# EAGLE design CC2530 Arduino Shield (EAGLE 9.5.0)
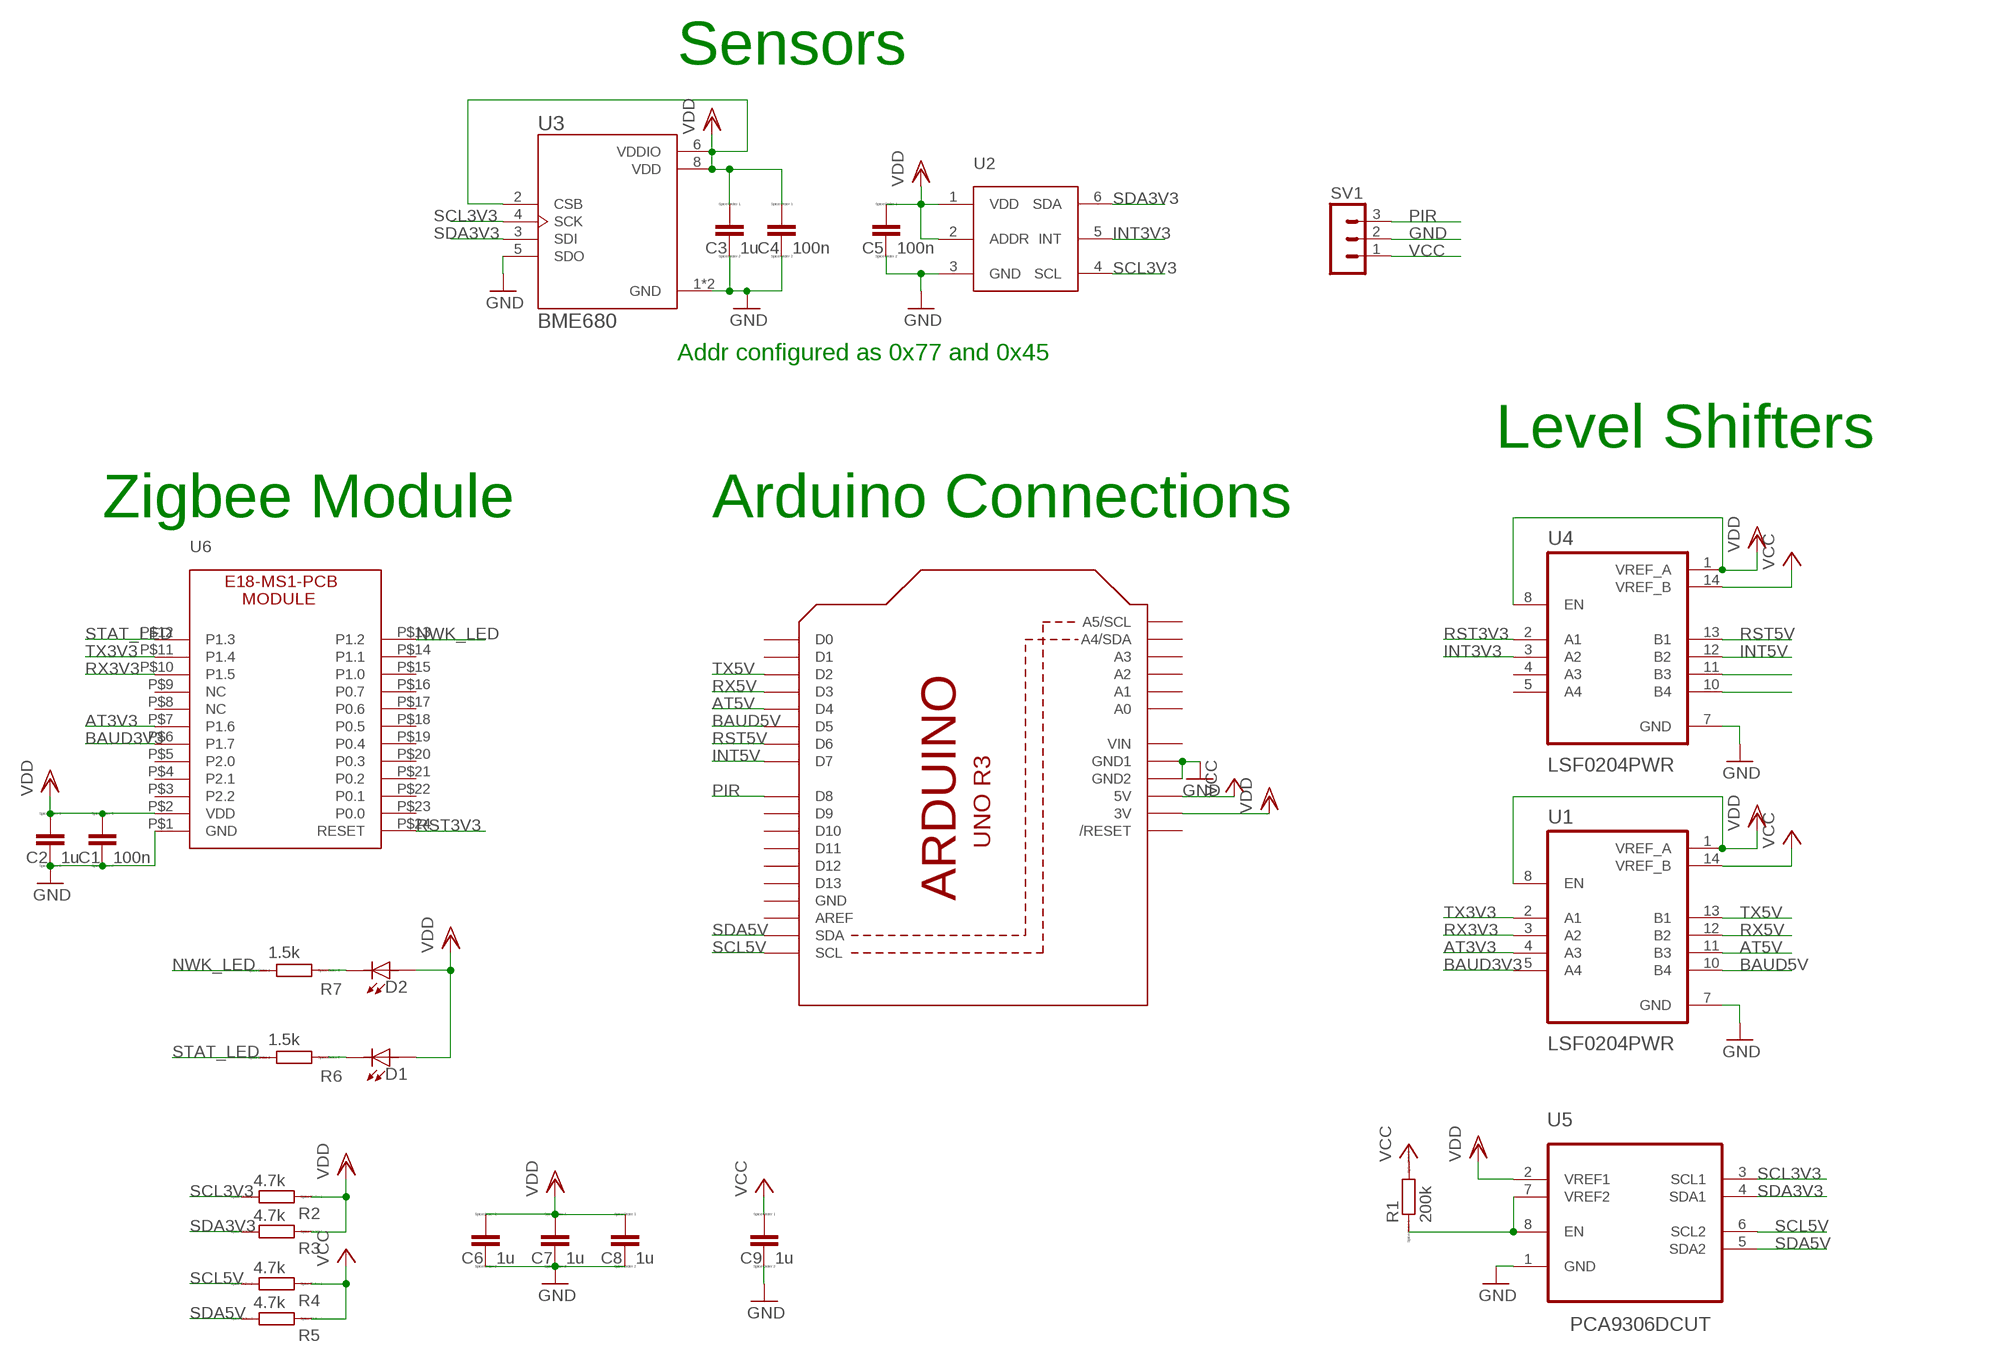
[diagram p0: schematic, sheet 1]

## Parts
C1  100n  CC0402  [C0402]
C2  1u  CC0402  [C0402]
C3  1u  CC0402  [C0402]
C4  100n  CC0402  [C0402]
C5  100n  CC0402  [C0402]
C6  1u  CC0402  [C0402]
C7  1u  CC0402  [C0402]
C8  1u  CC0402  [C0402]
C9  1u  CC0402  [C0402]
D1  VLMG1500-GS08  [LEDC1005X35N]
D2  VLMG1500-GS08  [LEDC1005X35N]
Q1  ARDUINOR3-NOIOREF-NOTEXT  [ARDUINOR3-NOTEXT-NOIOREF]
R1  200k  RR0402  [R0402]
R2  4.7k  RR0402  [R0402]
R3  4.7k  RR0402  [R0402]
R4  4.7k  RR0402  [R0402]
R5  4.7k  RR0402  [R0402]
R6  1.5k  RR0402  [R0402]
R7  1.5k  RR0402  [R0402]
SV1  MA03-1  [MA03-1]
U1  LSF0204PWR  [SOP65P640X120-14N]
U2  TI-OPT3001  [TI-OPT3001]
U3  BME680  [PSON80P300X300X100-8N]
U4  LSF0204PWR  [SOP65P640X120-14N]
U5  PCA9306DCUT  [SOP50P310X90-8N]
U6  E18  [E18-MS1-PCB]

## Nets
AT3V3: U1.4(A3) U6.P$7(P1.6)
AT5V: Q1.D4 U1.11(B3)
BAUD3V3: U1.5(A4) U6.P$6(P1.7)
BAUD5V: Q1.D5 U1.10(B4)
GND: C1.2 C2.2 C3.2 C4.2 C5.2 C6.2 C7.2 C8.2 C9.2 Q1.GND1 Q1.GND2 SV1.2 U1.7(GND) U2.3(GND) U3.1(GND) U3.5(SDO) U3.7(GND) U4.7(GND) U5.1(GND) U6.P$1(GND)
INT3V3: U2.5(INT) U4.3(A2)
INT5V: Q1.D7 U4.12(B2)
N$1: R1.1 U5.7(VREF2) U5.8(EN)
N$2: D2.2 R7.2
N$3: D1.2 R6.2
N$8: U4.11(B3)
N$9: U4.10(B4)
NWK_LED: R7.1 U6.P$13(P1.2)
PIR: Q1.D8 SV1.3
RST3V3: U4.2(A1) U6.P$24(RESET)
RST5V: Q1.D6 U4.13(B1)
RX3V3: U1.3(A2) U6.P$10(P1.5)
RX5V: Q1.D3 U1.12(B2)
SCL3V3: R2.2 U2.4(SCL) U3.4(SCK) U5.3(SCL1)
SCL5V: Q1.SCL R4.2 U5.6(SCL2)
SDA3V3: R3.2 U2.6(SDA) U3.3(SDI) U5.4(SDA1)
SDA5V: Q1.SDA R5.2 U5.5(SDA2)
STAT_LED: R6.1 U6.P$12(P1.3)
TX3V3: U1.2(A1) U6.P$11(P1.4)
TX5V: Q1.D2 U1.13(B1)
VCC: C9.1 Q1.5V R1.2 R4.1 R5.1 SV1.1 U1.14(VREF_B) U4.14(VREF_B)
VDD: C1.1 C2.1 C3.1 C4.1 C5.1 C6.1 C7.1 C8.1 D1.1 D2.1 Q1.3V R2.1 R3.1 U1.1(VREF_A) U1.8(EN) U2.1(VDD) U2.2(ADDR) U3.2(CSB) U3.6(VDDIO) U3.8(VDD) U4.1(VREF_A) U4.8(EN) U5.2(VREF1) U6.P$2(VDD)
Unconnected: Q1.A0 Q1.A1 Q1.A2 Q1.A3 Q1.A4(A4/SDA) Q1.A5(A5/SCL) Q1.AREF Q1.D0 Q1.D1 Q1.D9 Q1.D10 Q1.D11 Q1.D12 Q1.D13 Q1.RESET(/RESET) U4.4(A3) U4.5(A4) U6.P$3(P2.2) U6.P$4(P2.1) U6.P$5(P2.0) U6.P$8(NC) U6.P$9(NC) U6.P$14(P1.1) U6.P$15(P1.0) U6.P$16(P0.7) U6.P$17(P0.6) U6.P$18(P0.5) U6.P$19(P0.4) U6.P$20(P0.3) U6.P$21(P0.2) U6.P$22(P0.1) U6.P$23(P0.0)

## Notes on the sheet
- Sensors
- Addr configured as 0x77 and 0x45
- Level Shifters
- Zigbee Module | Arduino Connections

## Power pins joined to a net without a drawn wire
GND: Q1.GND
VIN: Q1.VIN

## Library data of the parts
C1-C9 = eagle-ltspice:C: CAPACITOR, European symbol; SPICEMODEL: NONE; SPICEPREFIX: C
D1 D2 = VLMG1500-GS08:VLMG1500-GS08: 0402 GREEN 571nm 35MCD 65° Rectangle with Flat Top SMT LED; AVAILABILITY: Unavailable; DESCRIPTION: 0402 GREEN 571nm 35MCD 65° Rectangle with Flat Top SMT LED; MF: Vishay; MP: VLMG1500-GS08; PACKAGE: 0402 Vishay; PRICE: None
Q1 = adafruit:ARDUINOR3-NOIOREF
R1-R7 = eagle-ltspice:R: RESISTOR, European symbol; SPICEMODEL: NONE; SPICEPREFIX: R
SV1 = con-lstb:MA03-1: PIN HEADER; OC_FARNELL: unknown; OC_NEWARK: unknown
U1 U4 = LSF0204PWR:LSF0204PWR: 4-Bit Bidirectional Multi-Voltage Level Translator for Open-Drain & Push- Pull 14-TSSOP -40 to 125; AVAILABILITY: Unavailable; DESCRIPTION: 4-Bit Bidirectional Multi-Voltage Level Translator for Open-Drain & Push- Pull 14-TSSOP -40 to 125; MF: Texas Instruments; MP: LSF0204PWR; PACKAGE: TSSOP-14 Texas Instruments; PRICE: None
U2 = FaBo-Mems:TI-OPT3001
U3 = BME680:BME680: Integrated Environmental Unit; AVAILABILITY: Unavailable; DESCRIPTION: Integrated Environmental Unit; MF: Bosch Sensortec; MP: BME680; PACKAGE: LGA-8 Bosch Tools; PRICE: None
U5 = PCA9306DCUT:PCA9306DCUT: VOLTAGE-LEVEL TRANSLATOR; AVAILABILITY: Unavailable; DESCRIPTION: Voltage Level Translator Bidirectional 1 Circuit 2 Channel 8-VSSOP; MF: Texas Instruments; MP: PCA9306DCU; PACKAGE: VFSOP-8 Texas Instruments; PRICE: None
U6 = E18:E18

## Board
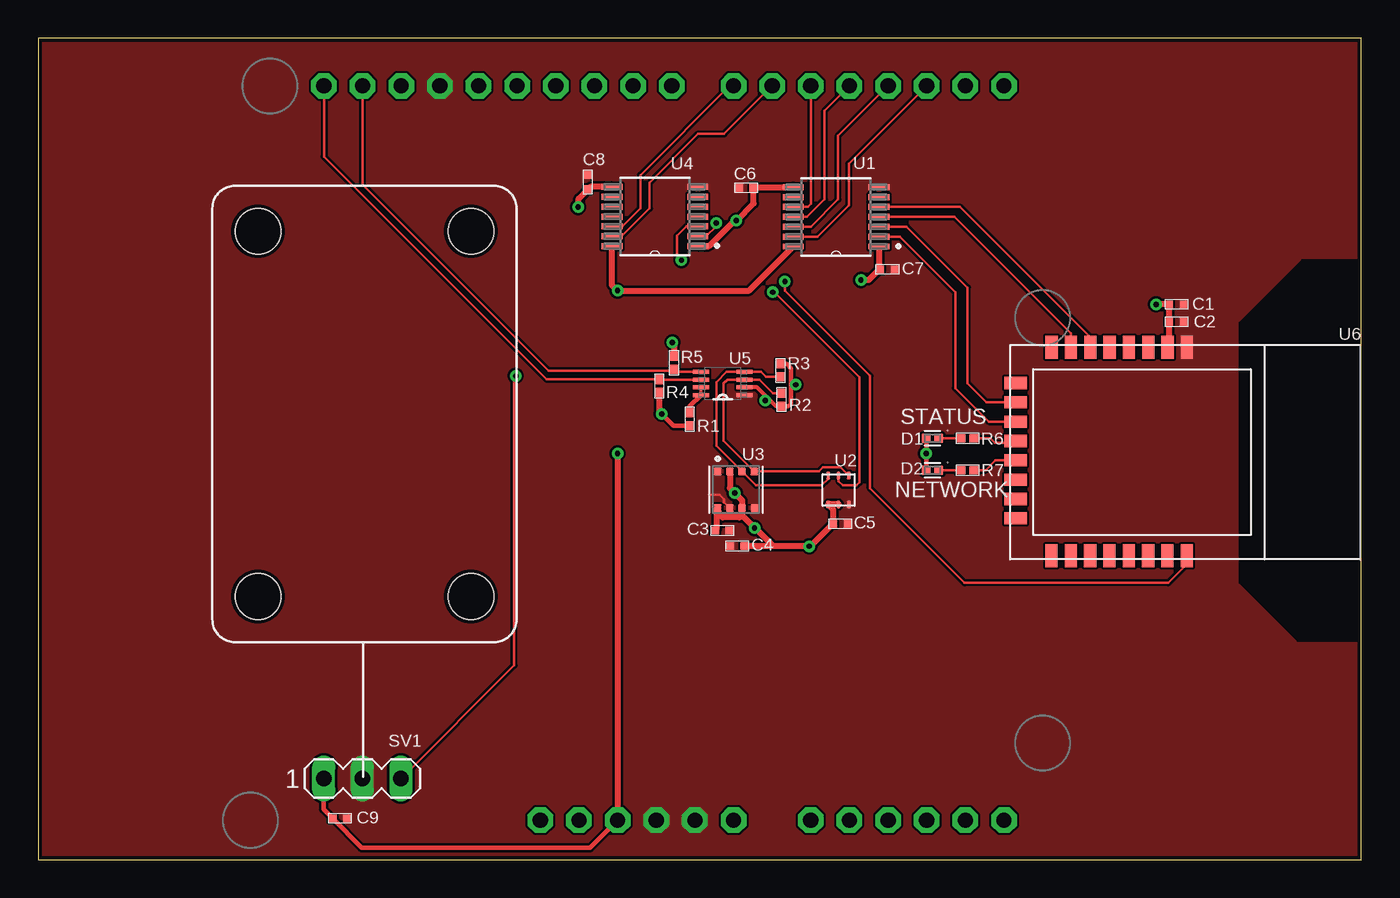
[diagram p1: board, top side]
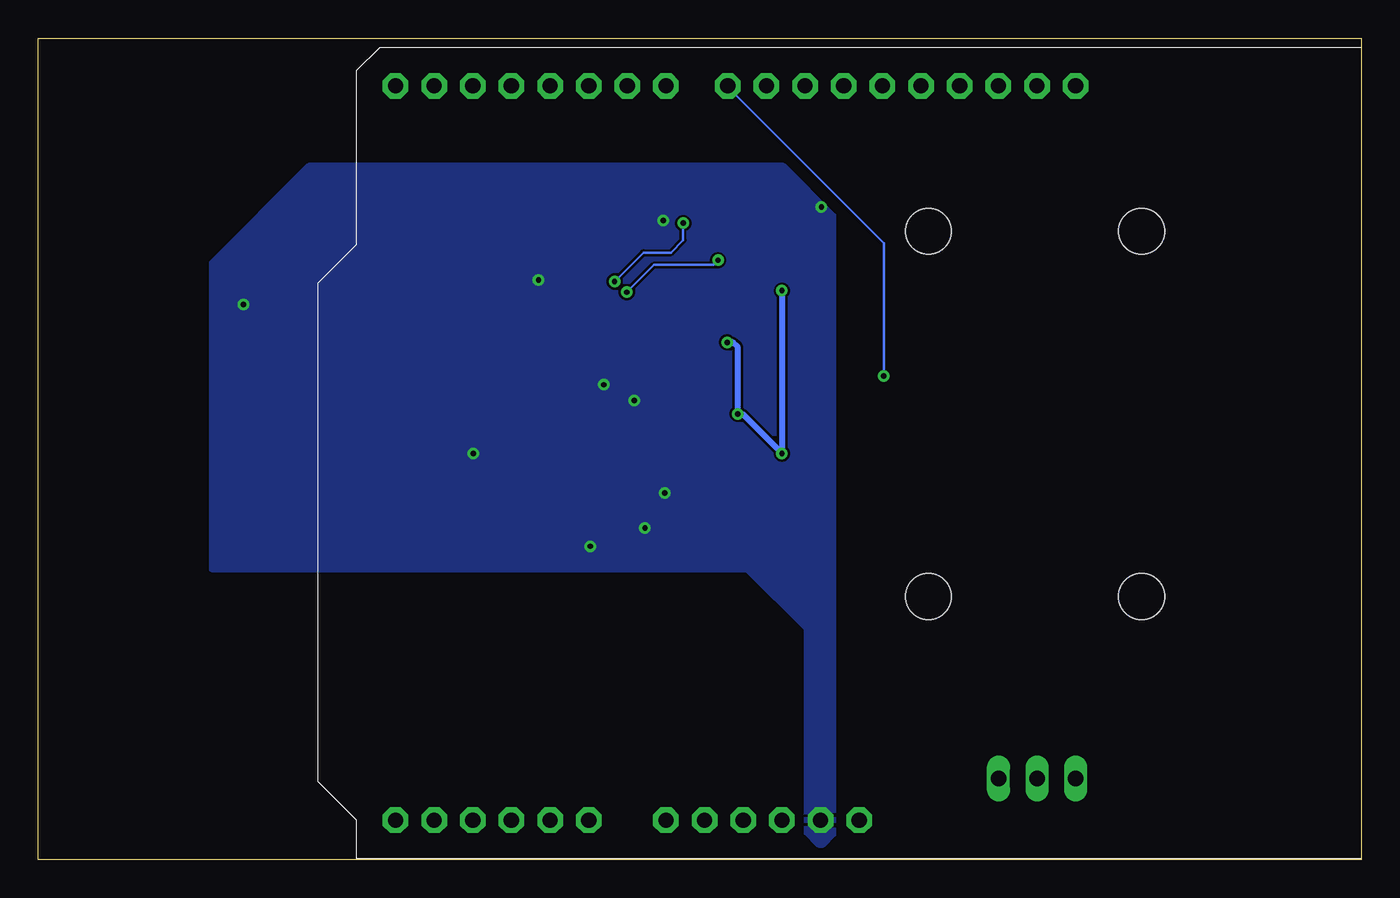
[diagram p2: board, bottom side, seen from below]

Size 87 x 54 mm. Coordinates in mm from the lower left corner, seen from the top.
Outline: 0,0 87,0 87,54 0,54 0,0
Copper layers (1*16): Top 0.035mm / dielectric 1.5mm / Bottom 0.035mm
Design rules "default *": minimum track width 6mil, minimum drill 0.35mm, track to track 6mil, track to pad 6mil, pad to pad 6mil, via to via 6mil, smd to smd 6mil, copper to edge 10mil, drill to drill 6mil, minimum pad ring 10mil, minimum via ring 8mil, stop-mask expansion 0mil, vias tented up to drill 40mil, thermal gap 0mil
Holes 3 mm at 28.46,41.3 14.46,41.3 14.46,17.3 28.46,17.3
tRestrict: area 79,14.4 to 87.1,39.4

### Footprints (pad centres in the part's own frame; a part is rotated, then mirrored left to right if it is on the bottom)
C0402 = smd 0.5 x 0.5: 1 -0.475,0; 2 0.475,0
LEDC1005X35N = smd 0.59 x 0.61: 1 -0.415,0; 2 0.415,0
ARDUINOR3-NOTEXT-NOIOREF = drill 1 pad 1.676 octagon: 3V 35.56,2.54; 5V 38.1,2.54; A0 50.8,2.54; A1 53.34,2.54; A2 55.88,2.54; A3 58.42,2.54; A4 60.96,2.54; A5 63.5,2.54; AREF 23.876,50.8; D0 63.5,50.8; D1 60.96,50.8; D2 58.42,50.8; D3 55.88,50.8; D4 53.34,50.8; D5 50.8,50.8; D6 48.26,50.8; D7 45.72,50.8; D8 41.656,50.8; D9 39.116,50.8; D10 36.576,50.8; D11 34.036,50.8; D12 31.496,50.8; D13 28.956,50.8; GND 26.416,50.8; GND1 43.18,2.54; GND2 40.64,2.54; RESET 33.02,2.54; SCL 18.796,50.8; SDA 21.336,50.8; VIN 45.72,2.54
R0402 = smd 0.6 x 0.55: 1 -0.425,0; 2 0.425,0
MA03-1 = drill 1.016 long: 1 -2.54,0; 2 0,0; 3 2.54,0
SOP65P640X120-14N = smd 1.37 x 0.39: 1 -2.82,1.95; 2 -2.82,1.3; 3 -2.82,0.65; 4 -2.82,0; 5 -2.82,-0.65; 6 -2.82,-1.3; 7 -2.82,-1.95; 8 2.82,-1.95; 9 2.82,-1.3; 10 2.82,-0.65; 11 2.82,0; 12 2.82,0.65; 13 2.82,1.3; 14 2.82,1.95
TI-OPT3001 = smd 0.5 x 0.25: 1 -0.95,0.675; 2 -0.95,0; 3 -0.95,-0.675; 4 0.95,-0.675; 5 0.95,0; 6 0.95,0.675
PSON80P300X300X100-8N = smd 0.5 x 0.5: 1 1.2,1.2; 2 1.2,0.4; 3 1.2,-0.4; 4 1.2,-1.2; 5 -1.2,-1.22; 6 -1.2,-0.4; 7 -1.2,0.4; 8 -1.2,1.2
SOP50P310X90-8N = smd 1.067 x 0.254: 1 -1.422,0.762; 2 -1.422,0.254; 3 -1.422,-0.254; 4 -1.422,-0.762; 5 1.422,-0.762; 6 1.422,-0.254; 7 1.422,0.254; 8 1.422,0.762
E18-MS1-PCB = smd 1.5 x 0.8: P$1 13.75,11.4; P$2 13.75,12.67; P$3 13.75,13.94; P$4 13.75,15.21; P$5 13.75,16.48; P$6 13.75,17.75; P$7 13.75,19.02; P$8 13.75,20.29; P$17 0.05,20.3; P$18 0.05,19.03; P$19 0.05,17.76; P$20 0.05,16.49; P$21 0.05,15.22; P$22 0.05,13.95; P$23 0.05,12.68; P$24 0.05,11.41 | smd 0.8 x 1.5: P$9 11.39,22.66; P$10 10.12,22.66; P$11 8.85,22.66; P$12 7.58,22.66; P$13 6.31,22.66; P$14 5.04,22.66; P$15 3.77,22.66; P$16 2.5,22.66

### Placement (x,y rotation side)
C1  74.84,36.5 0 top
C2  74.84,35.36 0 top
C3  44.98,21.64 0 top
C4  45.96,20.62 180 top
C5  52.74,22.08 0 top
C6  46.56,44.16 180 top
C7  55.84,38.8 0 top
C8  36.14,44.54 90 top
C9  19.84,2.72 0 top
D1  58.8,27.7 0 top
D2  58.8,25.6 0 top
Q1  0,0.06 0 top
R1  42.84,28.95 270 top
R2  48.86,30.24 90 top
R3  48.8,32.16 270 top
R4  40.84,31.14 90 top
R5  41.82,32.66 270 top
R6  61.1,27.7 180 top
R7  61.1,25.6 180 top
SV1  21.32,5.34 0 top
U1  52.46,42.25 180 top
U2  52.62,24.3 90 top
U3  45.88,24.32 90 top
U4  40.55,42.27 180 top
U5  45.01,31.3 180 top
U6  86.92,19.94 90 top

### Tracks (layer width: path | path; a pad name or v marks a point on that pad's centre or on a via)
AT3V3
  Top 0.152: U1.4 60.25,42.25 67.9,34.6 U6.P$7
AT5V
  Top 0.152: U1.11 50.55,42.25 51.7,43.4 51.7,49.22 Q1.D4
BAUD3V3
  Top 0.152: U1.5 60.6,42.9 69.2,34.3 69.2,33.72 U6.P$6
BAUD5V
  Top 0.152: U1.10 50.6,42.9 50.8,43.1 Q1.D5
GND
  Top 0.152: U3.7 45.1,23.5 45.1,23.7 44.8,24 44.1,24
  pour Top: 0.1,54.2 87.3,54.2 87.4,54.3 87.4,0.1 87.3,0 0.5,0 -0.2,0.7 -0.2,53.9
INT3V3  (via drill 0.35)
  Top 0.152: U2.5 52.62,24.88 52.9,24.6 53.8,24.6 54,24.8 54,31.7 48.4,37.3 v48.3,37.3 | v42.3,39.4 42,39.7 42,41 42.62,41.62 U4.3
  Bottom 0.152: v48.3,37.3 46.5,39.1 42.6,39.1 v42.3,39.4
INT5V
  Top 0.152: U4.12 38.42,41.62 39.6,42.8 39.6,45 45.46,50.86 Q1.D7
N$1
  Top 0.203: U5.8 U5.7
  Top 0.305: R1.1 42.84,29.79 U5.8
N$2
  Top 0.152: D2.2 R7.2
N$3
  Top 0.152: R6.2 D1.2
NWK_LED
  Top 0.152: R7.1 62.3,25.6 62.95,26.25 U6.P$13
PIR  (via drill 0.35)
  Top 0.152: SV1.3 31.3,12.78 31.3,31.7 v31.4,31.8
  Bottom 0.152: v31.4,31.8 31.4,40.5 41.66,50.76 Q1.D8
RST3V3  (via drill 0.35)
  Top 0.152: U6.P$24 75.51,19.41 74.3,18.2 60.9,18.2 54.7,24.4 54.7,31.8 49.1,37.4 v49.1,38 | v44.59,41.84 44.59,41.63 43.92,40.97 U4.2
  Bottom 0.152: v49.1,38 47.2,39.9 45.4,39.9 44.59,40.71 v44.59,41.84
RST5V
  Top 0.152: U4.13 38.37,40.97 40.2,42.8 40.2,44.5 43.4,47.7 45.1,47.7 Q1.D6
RX3V3
  Top 0.152: U6.P$10 62.34,30.06 61.1,31.3 61.1,37.6 57.1,41.6 U1.3
RX5V
  Top 0.152: U1.12 50.8,41.6 52.6,43.4 52.6,47.58 Q1.D3
SCL3V3
  Top 0.152: U2.4 52.74,25.8 51.6,25.8 51.32,25.52 U3.4 45.07,27.53 45.07,31.3 45.32,31.55 U5.3 47.43,31.55 48.31,30.66 R2.2
SCL5V
  Top 0.152: Q1.SCL 18.8,46.2 33.44,31.57 40.66,31.57 | 40.66,31.57 R4.2 40.94,31.66 | U5.6 40.67,31.55 40.66,31.57
SDA3V3
  Top 0.152: 48.7,31.63 R3.2 47.87,31.73 47.54,32.06 U5.4 45.26,32.06 44.59,31.39 44.59,27.21 U3.3 47.2,24.6 51.5,24.6 51.95,25.05 U2.6
SDA5V
  Top 0.152: Q1.SDA 21.34,44.36 33.56,32.13 41.72,32.13 R5.2 41.87,32.18 41.92,32.13 41.99,32.06 U5.5
STAT_LED
  Top 0.152: R6.1 62.6,27.7 62.9,27.4 64.14,27.4 U6.P$12
TX3V3
  Top 0.152: U1.2 56.65,40.95 60.3,37.3 60.3,31 62.51,28.79 U6.P$11
TX5V
  Top 0.152: U1.13 51.25,40.95 53.3,43 53.3,45.74 Q1.D2
VCC  (via drill 0.35)
  Top 0.305: Q1.5V 36.3,0.8 21.29,0.8 C9.1 18.78,3.31 SV1.1 | v41,29.3 41.77,28.52 R1.2
  Top 0.406: U1.14 46.74,37.4 v38.1,37.4 37.73,37.77 U4.14 | v41,29.3 40.84,29.46 R4.1 | v41.7,34 41.82,33.88 R5.1 | v38.1,26.7 Q1.5V
  Bottom 0.406: v38.1,37.4 v38.1,26.7 40.7,29.3 v41,29.3 41,33.7 41.3,34 v41.7,34
VDD  (via drill 0.35)
  Top 0.152: 49.22,32.59 49.25,32.55 | 49.5,32.2 49.5,32.1 | 49,29.82 R2.1 | 49.5,30 49.45,29.95 | C8.1 36.14,44.04 35.55,43.45 | C7.1 54.66,38.1 v54.1,38.1 | D2.1 58.38,25.7 | v49.8,31.22 49.77,31.19 49.5,31.19 | v47.81,30.19 47.95,30.34 47.98,30.34
  Top 0.254: R2.1 48.49,29.82 47.98,30.34 47.26,31.05 U5.2
  Top 0.305: D1.1 v58.38,26.7 58.38,25.7 | R3.1 49.22,32.59 | 49.25,32.55 49.5,32.3 49.5,32.2 | 49.5,32.1 49.5,31.19 49.5,30 | 49.45,29.95 49.31,29.82 49,29.82 | R2.1 48.74,29.7
  Top 0.406: U4.8 36.32,44.22 35.55,43.45 35.5,43.4 v35.5,42.9 | U4.1 44.1,40.32 45.78,42 v45.9,42 47.03,43.13 C6.1 47.08,44.2 U1.8 | U1.1 55.28,38.78 54.6,38.1 v54.1,38.1 | U6.P$2 74.35,33.79 74.35,35.34 C2.1 C1.1 v73.5,36.5 | 46.28,22.68 U3.6 46.28,23.62 v45.8,24.1 45.48,24.42 U3.2 | 46.28,22.68 46.1,22.5 45,22.5 44.68,22.82 U3.8 44.6,23.05 44.6,21.74 C3.1 | C4.1 48.3,20.62 | 48.3,20.62 50.8,20.62 C5.1 52.27,23.03 U2.1 U2.2 | 48.3,20.62 46.28,22.64 46.28,22.68
  other vias: 50.7,20.6 47.1,21.8
  pour Bottom: 34.7,42.3 38,45.6 69.2,45.6 75.6,39.2 75.6,19.1 40.4,19.1 36.5,15.2 36.5,1.8 35.7,1 35.4,1 34.7,1.7

### Text on the board
tPlace: C8 | U4 | C6 | U1 | C7 | C1 | C2 | U6 | R5 | U5 | R3 | R4 | R2 | STATUS | R1 | D1 | R6 | U3 | U2 | D2 | R7 | NETWORK | C5 | C3 | C4 | SV1 | C9